# Altium schematic sheet Sheet1.SchDoc
size 209 x 297 mm; SheetNumber: 1; SheetTotal: 1
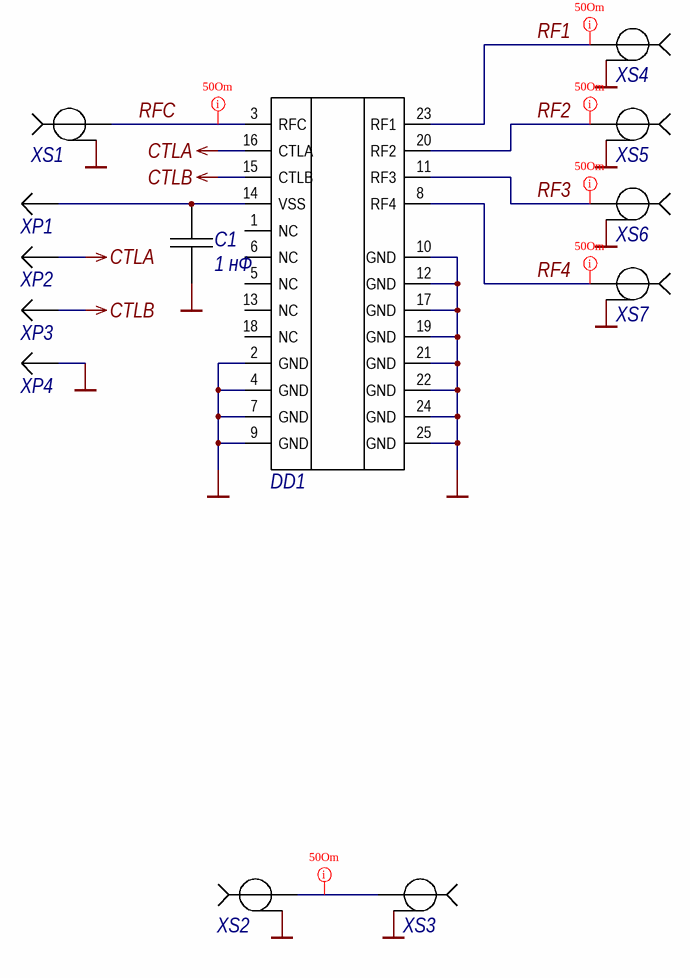
[diagram p0: Sheet1.SchDoc]

## Parts
C1  Capacitance: 1 нФ  [FP-C0402--IPC_A]  (hidden comment: С-0402 1 нФ 50 В C0G TDK Corporation)
DD1  HMC641ALP4 Analog Devices  [LFCSP 24 lead 4x4 mm]  (value not drawn)
XP1  HDR-M-2.54_1X1 Yuandi  [pinHeader-M-2.54_1X1]  (value not drawn)
XP2  HDR-M-2.54_1X1 Yuandi  [pinHeader-M-2.54_1X1]  (value not drawn)
XP3  HDR-M-2.54_1X1 Yuandi  [pinHeader-M-2.54_1X1]  (value not drawn)
XP4  HDR-M-2.54_1X1 Yuandi  [pinHeader-M-2.54_1X1]  (value not drawn)
XS1  901-10511-2 Amphenol RF  [SMA]  (value not drawn)
XS2  901-10511-2 Amphenol RF  [SMA]  (value not drawn)
XS3  901-10511-2 Amphenol RF  [SMA]  (value not drawn)
XS4  901-10511-2 Amphenol RF  [SMA]  (value not drawn)
XS5  901-10511-2 Amphenol RF  [SMA]  (value not drawn)
XS6  901-10511-2 Amphenol RF  [SMA]  (value not drawn)
XS7  901-10511-2 Amphenol RF  [SMA]  (value not drawn)

## Nets
CTLA: DD1.16(CTLA) XP2.1
CTLB: DD1.15(CTLB) XP3.1
GND: C1.2 DD1.2(GND) DD1.4(GND) DD1.7(GND) DD1.9(GND) DD1.10(GND) DD1.12(GND) DD1.17(GND) DD1.19(GND) DD1.21(GND) DD1.22(GND) DD1.24(GND) DD1.25(GND) XP4.1 XS1.2 XS2.2 XS3.2 XS4.2 XS5.2 XS6.2 XS7.2
RF1: DD1.23(RF1) XS4.1
RF2: DD1.20(RF2) XS5.1
RF3: DD1.11(RF3) XS6.1
RF4: DD1.8(RF4) XS7.1
RFC: DD1.3(RFC) XS1.1
NetC1_1: C1.1 DD1.14(VSS) XP1.1
NetXS2_1: XS2.1 XS3.1

Not connected (* = marked no-connect by the designer): DD1 1(NC) 5(NC) 6(NC) 13(NC) 18(NC)

## Layout directives
net class RF: NetXS2_1, RF1, RF2, RF3, RF4, RFC

## Notes on the sheet
- Перв. застосув.
- Справ. №
- Підп. дата
- Інв. № дубл.
- Взам. інв. №
- Підп. та дата
- Зм.
- Розроб.
- Арк.
- № докум.
- Підп.
- Дата
- Літ.
- Маса
- Маштаб
- Перев.
- Аркушів
- Інв. № подл.
- Н.контр.
- Затв.
- КПІ ім. Ігоря Сікорського
- Копіював
- Формат А4

## Library data of the parts
C1 = C0402_1000pF_50V_C1005C0G1H102F050BA: Name: Capasitor; Voltage: 50 В; Package: С-0402; Manufacturer: TDK Corporation; Material: C0G
DD1 = EV1HMC641ALP4: IC RF SWITCH SP4T 20GHZ 24QFN; Name: HMC641ALP4; Package: 24-lead, 4 mm × 4 mm LFCSP; Manufacturer: Analog Devices; Datasheet: https://www.analog.com/en/products/hmc641alp4e.html?doc=hmc641alp4e.pdf
XP1-XP4 = HDR-M-2.54_1X1: Name: HDR-M-2.54_1X1; Manufacturer: Yuandi
XS1-XS7 = SMA_Amphenol RF_901-10511-2: SMA Connector Jack, Female Socket 50 Ohms Board Edge, End Launch Solder; Name: 901-10511-2; Manufacturer: Amphenol RF